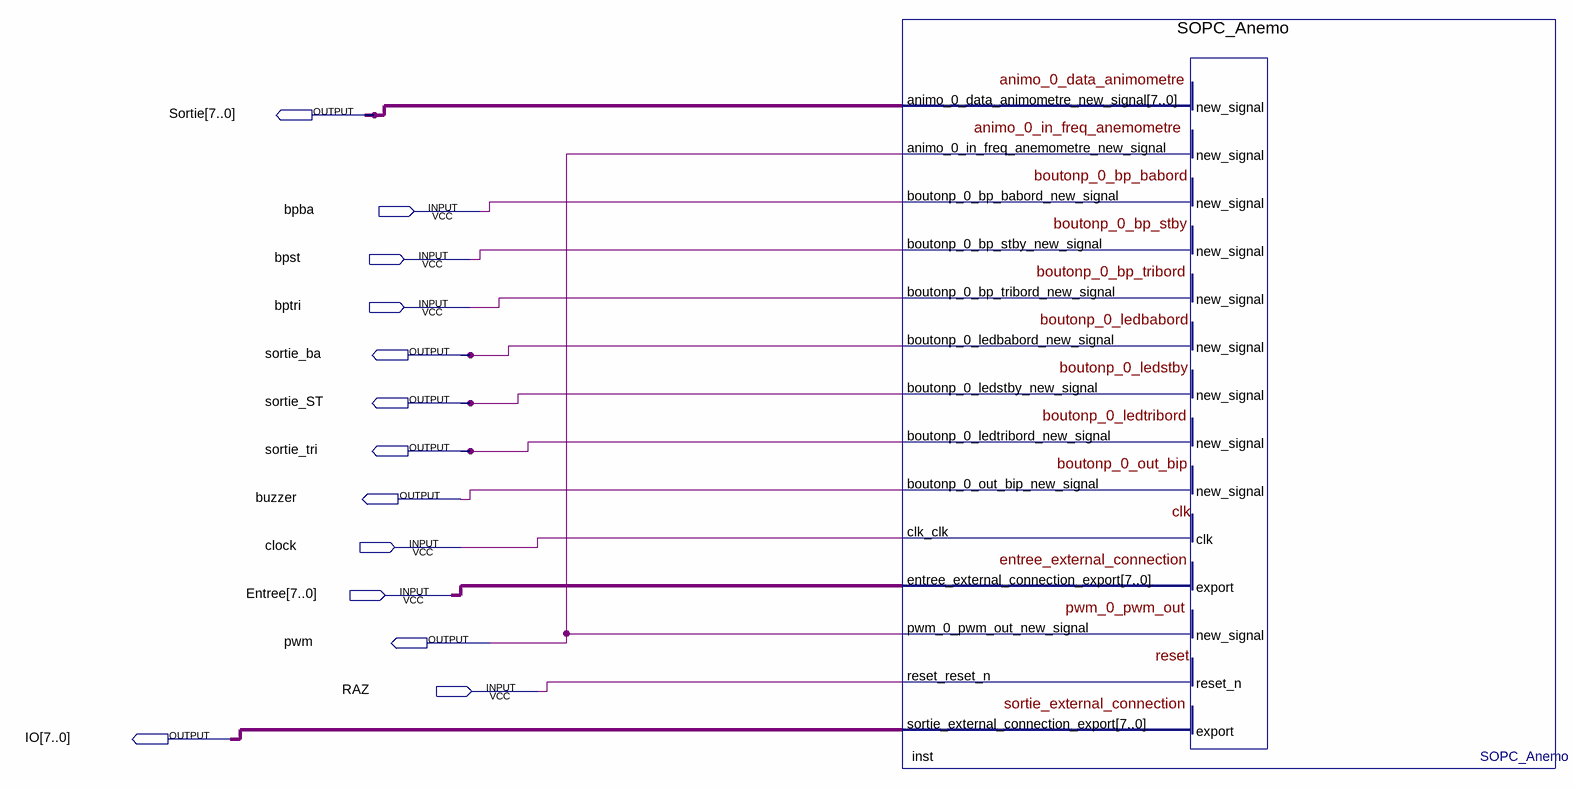
[diagram p0: schematic sheet]
// Quartus schematic SOPC_Anemo_block.bdf as structural Verilog: 1 symbols, 13 pins
module SOPC_Anemo_block (
  input  bpba,
  input  bpst,
  input  bptri,
  input  clock,
  input  [7:0] Entree,
  input  RAZ,
  output [7:0] Sortie,
  output sortie_ba,
  output sortie_ST,
  output sortie_tri,
  output buzzer,
  output pwm,
  output [7:0] IO
);

  SOPC_Anemo inst (
    .animo_0_in_freq_anemometre_new_signal(pwm), .boutonp_0_bp_babord_new_signal(bpba),
    .boutonp_0_bp_stby_new_signal(bpst), .boutonp_0_bp_tribord_new_signal(bptri), .clk_clk(clock),
    .entree_external_connection_export(Entree), .reset_reset_n(RAZ),
    .animo_0_data_animometre_new_signal(Sortie), .boutonp_0_ledbabord_new_signal(sortie_ba),
    .boutonp_0_ledstby_new_signal(sortie_ST), .boutonp_0_ledtribord_new_signal(sortie_tri),
    .boutonp_0_out_bip_new_signal(buzzer), .pwm_0_pwm_out_new_signal(pwm),
    .sortie_external_connection_export(IO));
endmodule
